# Altium schematic sheet fonte.SchDoc
size A4
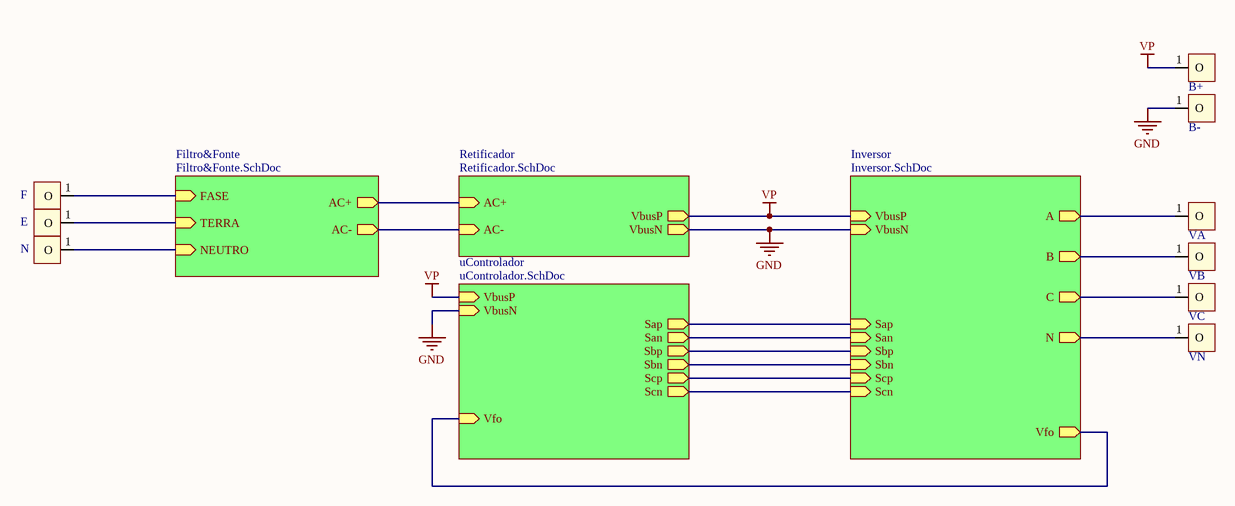
[diagram p0: fonte.SchDoc]

## Parts
B+  PIN  [PIN]  (value not drawn)
B-  PIN  [PIN]  (value not drawn)
E  PIN  [PIN]  (value not drawn)
F  PIN  [PIN]  (value not drawn)
N  PIN  [PIN]  (value not drawn)
VA  PIN  [PIN]  (value not drawn)
VB  PIN  [PIN]  (value not drawn)
VC  PIN  [PIN]  (value not drawn)
VN  PIN  [PIN]  (value not drawn)

## Sub-sheets
Filtro&Fonte = Filtro&Fonte.SchDoc: AC+ (out), AC- (out), FASE (in), TERRA (in), NEUTRO (in)
Inversor = Inversor.SchDoc: A (out), B (out), C (out), VbusP (in), VbusN (in), Sap (in), Sbp (in), San (in), Sbn (in), Scp (in), Scn (in), N (out), Vfo (out)
Retificador = Retificador.SchDoc: VbusP (out), VbusN (out), AC+ (in), AC- (in)
uControlador = uControlador.SchDoc: VbusP (in), VbusN (in), Sap (out), Sbp (out), San (out), Sbn (out), Scp (out), Scn (out), Vfo (in)

## Nets
GND: B-.1(O) ; sheet Inversor/VbusN, sheet uControlador/VbusN, sheet Retificador/VbusN
VP: B+.1(O) ; sheet Inversor/VbusP, sheet uControlador/VbusP, sheet Retificador/VbusP
NetE_1: E.1(O) ; sheet Filtro&Fonte/TERRA
NetF_1: F.1(O) ; sheet Filtro&Fonte/FASE
NetN_1: N.1(O) ; sheet Filtro&Fonte/NEUTRO
NetVA_1: VA.1(O) ; sheet Inversor/A
NetVB_1: VB.1(O) ; sheet Inversor/B
NetVC_1: VC.1(O) ; sheet Inversor/C
NetVN_1: VN.1(O) ; sheet Inversor/N
(unnamed): sheet Inversor/Sap, sheet uControlador/Sap
(unnamed): sheet Inversor/Sbp, sheet uControlador/Sbp
(unnamed): sheet Inversor/San, sheet uControlador/San
(unnamed): sheet Inversor/Sbn, sheet uControlador/Sbn
(unnamed): sheet Inversor/Scp, sheet uControlador/Scp
(unnamed): sheet Inversor/Scn, sheet uControlador/Scn
(unnamed): sheet Inversor/Vfo, sheet uControlador/Vfo
(unnamed): sheet Retificador/AC+, sheet Filtro&Fonte/AC+
(unnamed): sheet Retificador/AC-, sheet Filtro&Fonte/AC-

## Library data of the parts
B+ B- E F N VA VB VC VN = PIN: Generic pin